# EAGLE schematic TopPCB (EAGLE 6.3)
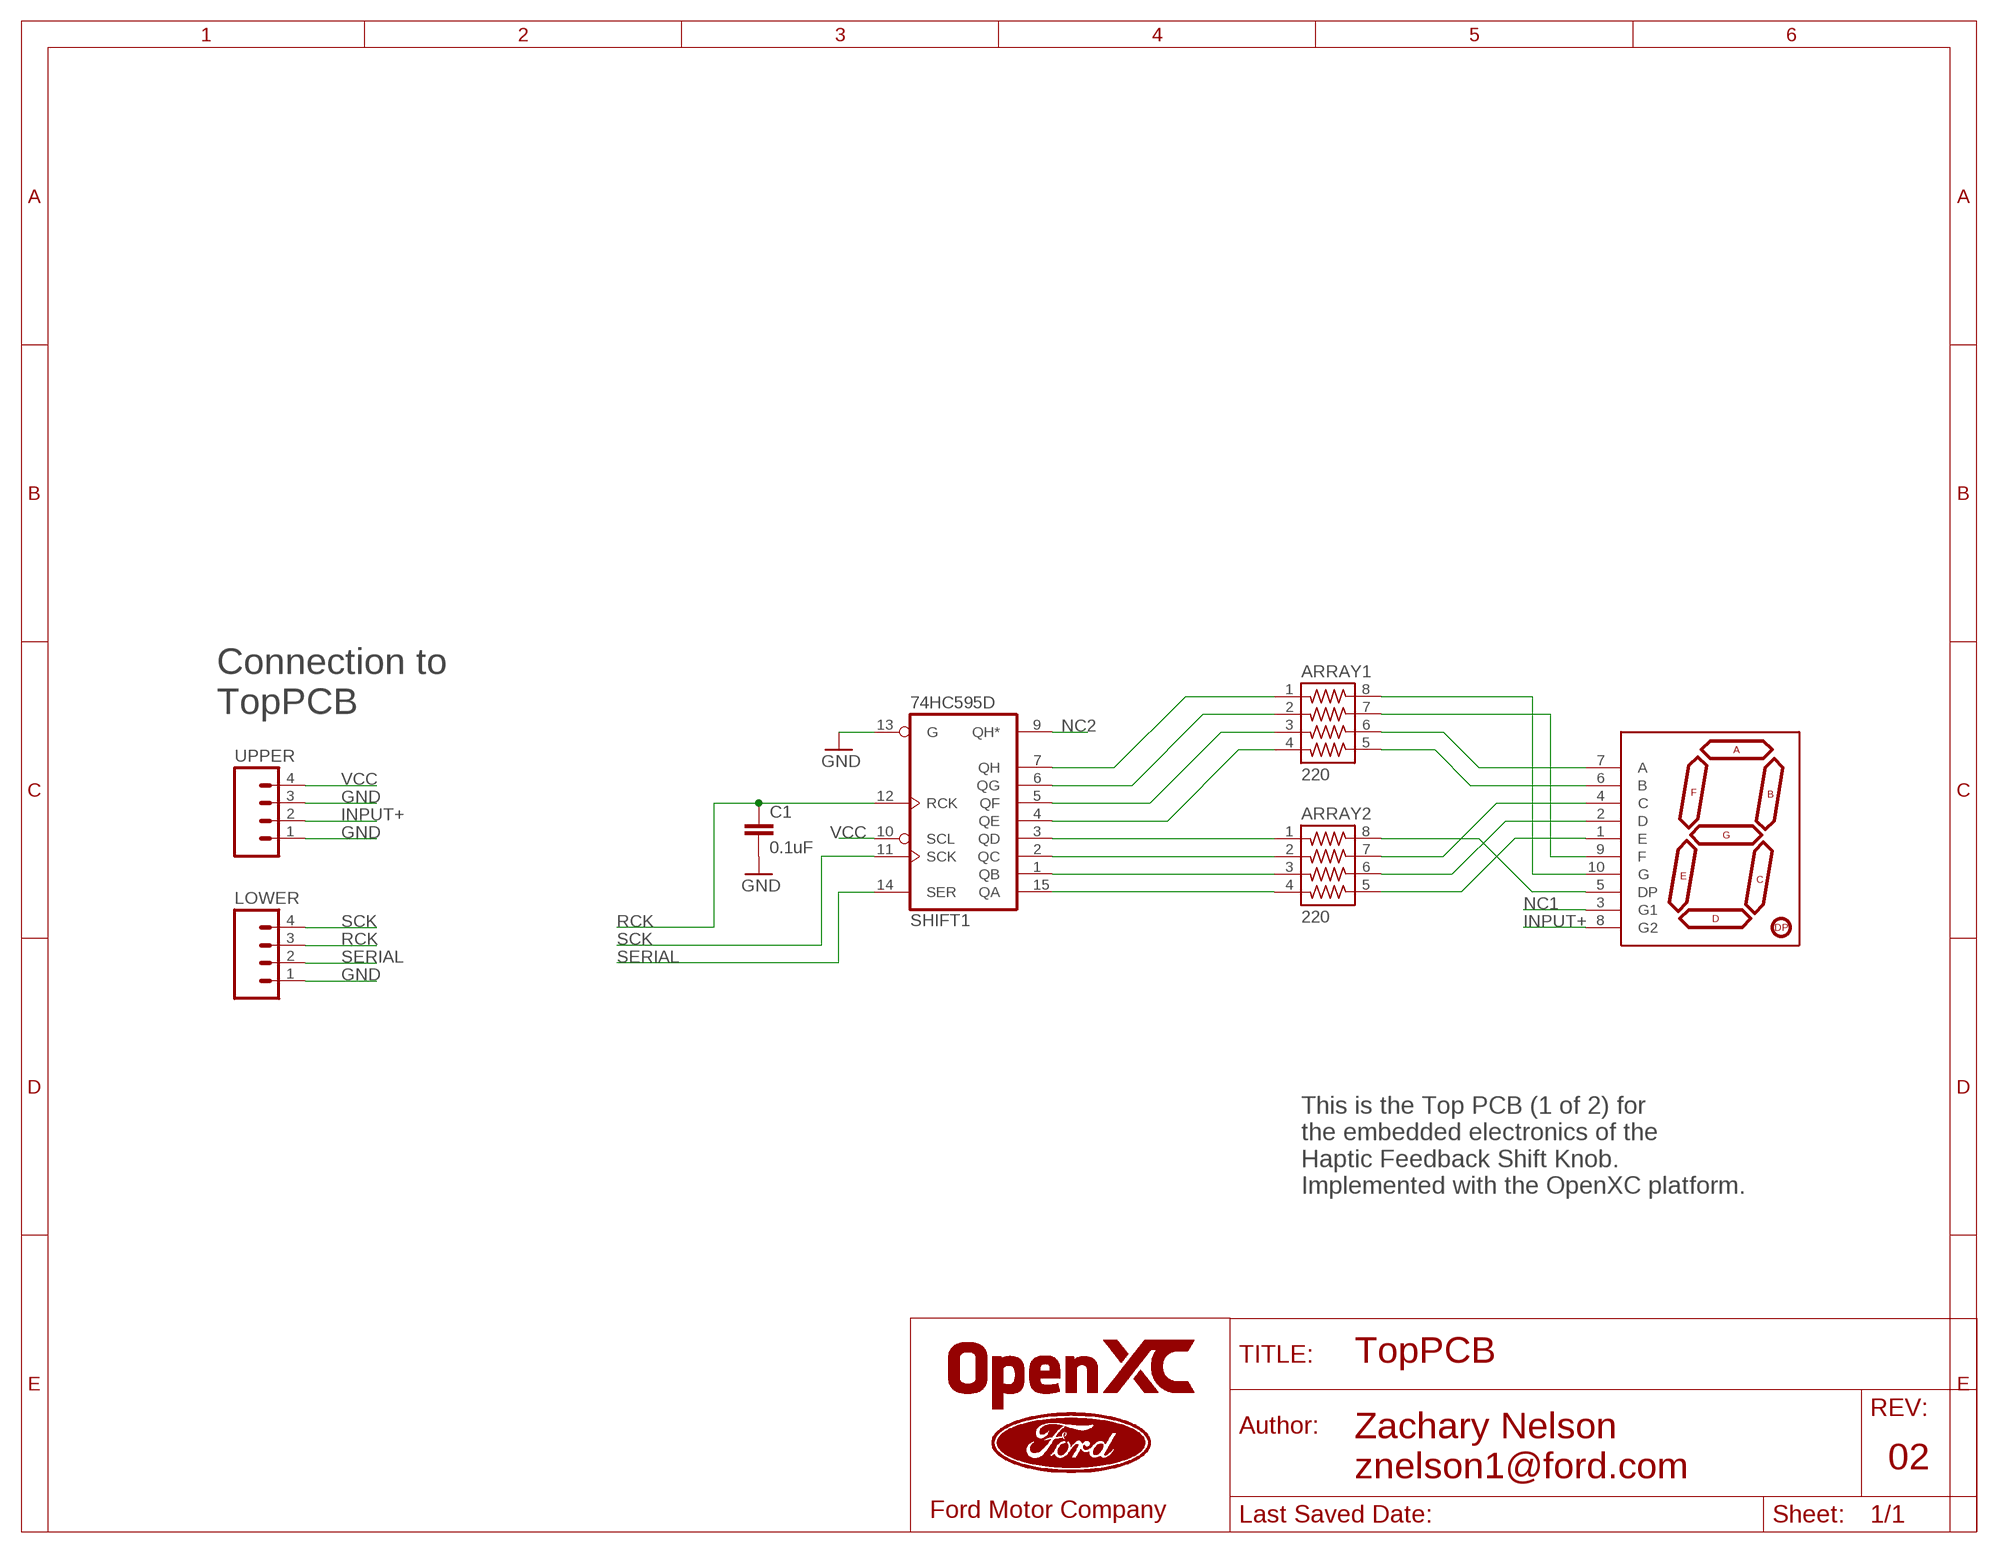
[diagram p0: schematic, sheet 1]

## Parts
7SEGMENT  7-SEGMENT-DISPLAY-1"-RED  [7-SEGMENT-1"PTH]
ARRAY1  220  744-8  [744-8]
ARRAY2  220  744-8  [744-8]
C1  0.1uF  CAP0402-CAP  [0402-CAP]
LOWER  M04PTH  [1X04]
SHIFT1  74HC595D  [SO16]
UPPER  M04PTH  [1X04]

## Nets
GND: C1.2 LOWER.1 SHIFT1.13(G) UPPER.1 UPPER.3
INPUT+: 7SEGMENT.8(G2) UPPER.2
N$1: 7SEGMENT.5(DP) ARRAY2.8
N$2: ARRAY2.3 SHIFT1.1(QB)
N$3: 7SEGMENT.1(E) ARRAY2.5
N$4: ARRAY2.2 SHIFT1.2(QC)
N$5: ARRAY2.1 SHIFT1.3(QD)
N$7: 7SEGMENT.4(C) ARRAY2.7
N$8: 7SEGMENT.6(B) ARRAY1.5
N$9: ARRAY2.4 SHIFT1.15(QA)
N$10: ARRAY1.4 SHIFT1.4(QE)
N$11: ARRAY1.3 SHIFT1.5(QF)
N$12: ARRAY1.2 SHIFT1.6(QG)
N$13: ARRAY1.1 SHIFT1.7(QH)
N$14: 7SEGMENT.7(A) ARRAY1.6
N$15: 7SEGMENT.9(F) ARRAY1.7
N$16: 7SEGMENT.10(G) ARRAY1.8
N$19: 7SEGMENT.2(D) ARRAY2.6
NC1: 7SEGMENT.3(G1)
NC2: SHIFT1.9(QH*)
RCK: C1.1 LOWER.3 SHIFT1.12(RCK)
SCK: LOWER.4 SHIFT1.11(SCK)
SERIAL: LOWER.2 SHIFT1.14(SER)
VCC: SHIFT1.10(SCL) UPPER.4

## Notes on the sheet
- Connection to 
  TopPCB
- This is the Top PCB (1 of 2) for 
  the embedded electronics of the 
  Haptic Feedback Shift Knob. 
  Implemented with the OpenXC platform.
- 02
- Zachary Nelson
  znelson1@ford.com

## Power pins joined to a net without a drawn wire
GND: SHIFT1.8(GND)
VCC: SHIFT1.16(VCC)

## Library data of the parts
7SEGMENT = SparkFun-Displays:7-SEGMENT-DISPLAY-1"-RED: 7-Segment Display 1" Red (COM-08546)
ARRAY1 ARRAY2 = resistor-array:744-8: CTS 744 Series 4 Resistors, 8 Terminations
C1 = SparkFun-Capacitors:CAP: Capacitor Standard 0603 ceramic capacitor, and 0.1" leaded capacitor.
LOWER UPPER = SparkFun-Connectors:M04: Header 4 Standard 4-pin 0.1" header. Use with straight break away headers (SKU : PRT-00116), right angle break away headers (PRT-00553), swiss pins (PRT-00743), machine pins (PRT-00117), and female headers (PRT-00115). Molex polarized connector foot print use with SKU : PRT-08231 with associated crimp pins and housings. 1MM SMD Version SKU: PRT-10208
SHIFT1 = 74xx-eu:74*595: 8-bit SHIFT REGISTER, output latch